# EAGLE design msp432mini_rev1.3 (EAGLE 9.6.1)
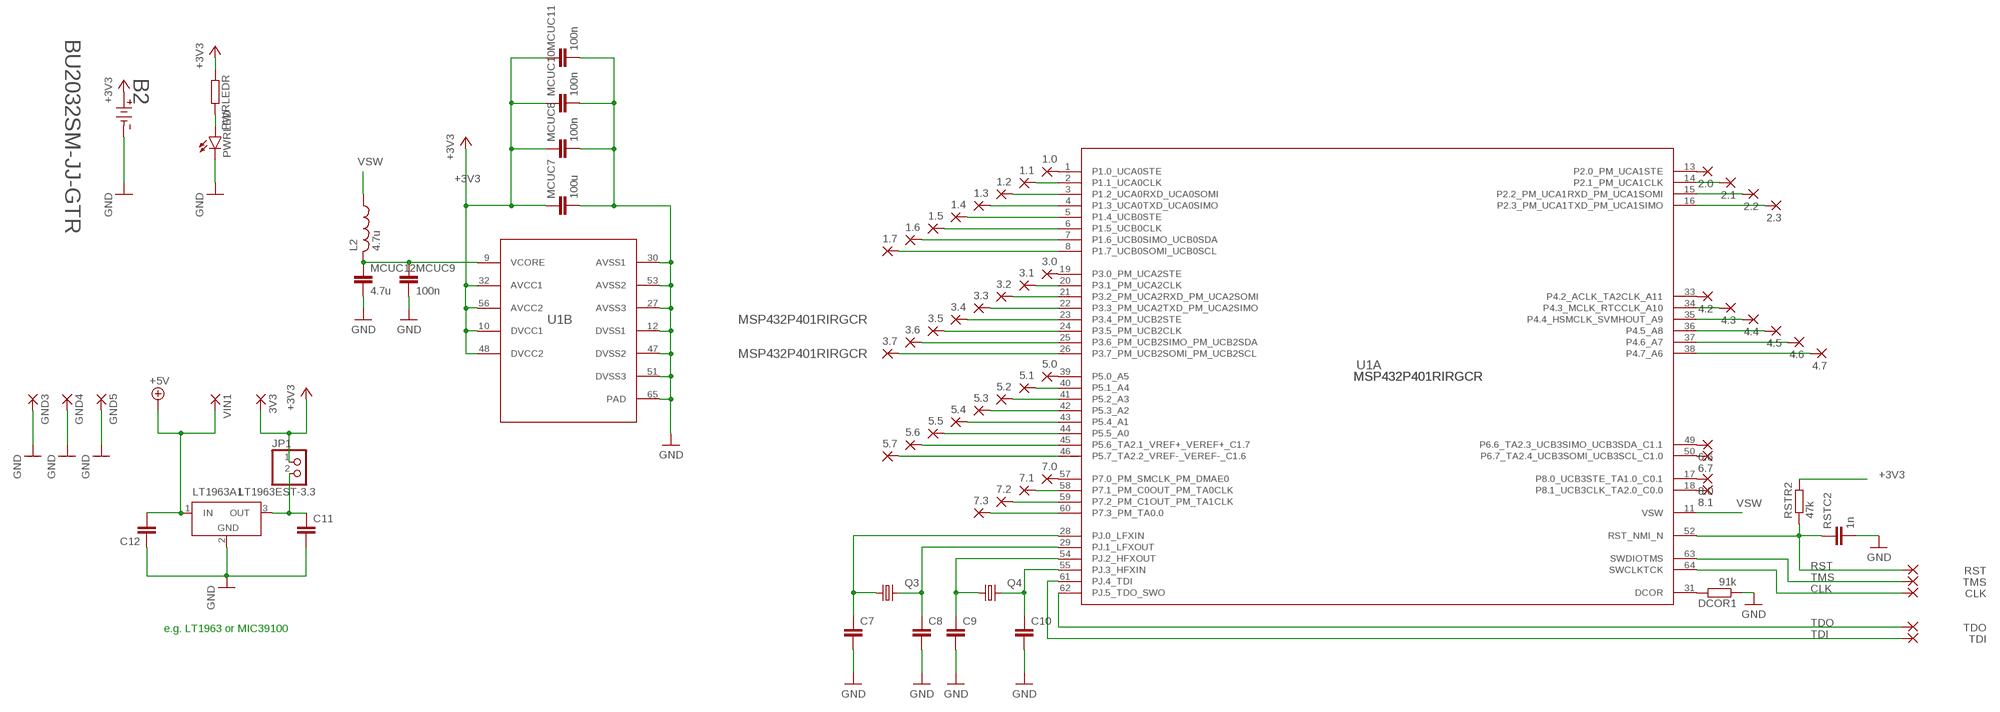
[diagram p0: schematic, sheet 1]

## Parts
1.0  1,6/0,9  [1,6/0,9]
1.1  1,6/0,9  [1,6/0,9]
1.2  1,6/0,9  [1,6/0,9]
1.3  1,6/0,9  [1,6/0,9]
1.4  1,6/0,9  [1,6/0,9]
1.5  1,6/0,9  [1,6/0,9]
1.6  1,6/0,9  [1,6/0,9]
1.7  1,6/0,9  [1,6/0,9]
2.0  1,6/0,9  [1,6/0,9]
2.1  1,6/0,9  [1,6/0,9]
2.2  1,6/0,9  [1,6/0,9]
2.3  1,6/0,9  [1,6/0,9]
3.0  1,6/0,9  [1,6/0,9]
3.1  1,6/0,9  [1,6/0,9]
3.2  1,6/0,9  [1,6/0,9]
3.3  1,6/0,9  [1,6/0,9]
3.4  1,6/0,9  [1,6/0,9]
3.5  1,6/0,9  [1,6/0,9]
3.6  1,6/0,9  [1,6/0,9]
3.7  1,6/0,9  [1,6/0,9]
3V3  1,6/0,9  [1,6/0,9]
4.2  1,6/0,9  [1,6/0,9]
4.3  1,6/0,9  [1,6/0,9]
4.4  1,6/0,9  [1,6/0,9]
4.5  1,6/0,9  [1,6/0,9]
4.6  1,6/0,9  [1,6/0,9]
4.7  1,6/0,9  [1,6/0,9]
5.0  1,6/0,9  [1,6/0,9]
5.1  1,6/0,9  [1,6/0,9]
5.2  1,6/0,9  [1,6/0,9]
5.3  1,6/0,9  [1,6/0,9]
5.4  1,6/0,9  [1,6/0,9]
5.5  1,6/0,9  [1,6/0,9]
5.6  1,6/0,9  [1,6/0,9]
5.7  1,6/0,9  [1,6/0,9]
6.6  1,6/0,9  [1,6/0,9]
6.7  1,6/0,9  [1,6/0,9]
7.0  1,6/0,9  [1,6/0,9]
7.1  1,6/0,9  [1,6/0,9]
7.2  1,6/0,9  [1,6/0,9]
7.3  1,6/0,9  [1,6/0,9]
8.0  1,6/0,9  [1,6/0,9]
8.1  1,6/0,9  [1,6/0,9]
B2  BU2032SM-JJ-GTR  [BU2032SM-JJ-GTR_MPD]
C7  C-EUC0402K  [C0402K]
C8  C-EUC0402K  [C0402K]
C9  C-EUC0402K  [C0402K]
C10  C-EUC0402K  [C0402K]
C11  C-EUC1206K  [C1206K]
C12  C-EUC1206K  [C1206K]
CLK  1,6/0,9  [1,6/0,9]
DCOR1  91k  R-EU_R0603  [R0603]
GND3  1,6/0,9  [1,6/0,9]
GND4  1,6/0,9  [1,6/0,9]
GND5  1,6/0,9  [1,6/0,9]
JP1  PINHD-1X2  [1X02]
L2  4.7u  L-USL2012C  [L2012C]
LT1963A1  LT1963EST-3.3  [SOT223]
MCUC7  100u  C-EUC1206K  [C1206K]
MCUC8  100n  C-EUC0603K  [C0603K]
MCUC9  100n  C-EUC0603K  [C0603K]
MCUC10  100n  C-EUC0603K  [C0603K]
MCUC11  100n  C-EUC0603K  [C0603K]
MCUC12  4.7u  C-EUC0603K  [C0603K]
PWRLED  LEDCHIP-LED0805  [CHIP-LED0805]
PWRLEDR  R-EU_R0603  [R0603]
Q3  KX-327-NHF  [3.2X1.5]
Q4  KX-7  [3.2X2.5_KX-7]
RST  1,6/0,9  [1,6/0,9]
RSTC2  1n  C-EUC0603K  [C0603K]
RSTR2  47k  R-EU_R0603  [R0603]
TDI  1,6/0,9  [1,6/0,9]
TDO  1,6/0,9  [1,6/0,9]
TMS  1,6/0,9  [1,6/0,9]
U1  MSP432P401RIRGCR  [RGC0064B]
VIN1  1,6/0,9  [1,6/0,9]

## Nets
+3V3: 3V3.1(P) B2.2 JP1.1 MCUC7.1 MCUC8.1 MCUC10.1 MCUC11.1 PWRLEDR.1 RSTR2.2 U1.10(B:DVCC1) U1.32(B:AVCC1) U1.48(B:DVCC2) U1.56(B:AVCC2)
+5V: C12.2 LT1963A1.1(IN) VIN1.1(P)
CLK: CLK.1(P) U1.64(A:SWCLKTCK)
GND: B2.1 C7.2 C8.2 C9.2 C10.2 C11.2 C12.1 DCOR1.1 GND3.1(P) GND4.1(P) GND5.1(P) LT1963A1.2(GND) MCUC7.2 MCUC8.2 MCUC9.2 MCUC10.2 MCUC11.2 MCUC12.2 PWRLED.C RSTC2.2 U1.12(B:DVSS1) U1.27(B:AVSS3) U1.30(B:AVSS1) U1.47(B:DVSS2) U1.51(B:DVSS3) U1.53(B:AVSS2) U1.65(B:PAD)
N$1: C11.1 JP1.2 LT1963A1.3(OUT)
N$48: L2.2 MCUC9.1 MCUC12.1 U1.9(B:VCORE)
N$51: C7.1 Q3.1 U1.28(A:PJ.0_LFXIN)
N$53: C8.1 Q3.2 U1.29(A:PJ.1_LFXOUT)
N$54: 5.0.1(P) U1.39(A:P5.0_A5)
N$55: 4.2.1(P) U1.33(A:P4.2_ACLK_TA2CLK_A11)
N$56: PWRLED.A PWRLEDR.2
N$57: C10.1 Q4.3 U1.55(A:PJ.3_HFXIN)
N$58: C9.1 Q4.1 U1.54(A:PJ.2_HFXOUT)
N$59: 3.0.1(P) U1.19(A:P3.0_PM_UCA2STE)
N$60: 3.1.1(P) U1.20(A:P3.1_PM_UCA2CLK)
N$61: 3.2.1(P) U1.21(A:P3.2_PM_UCA2RXD_PM_UCA2SOMI)
N$62: 3.3.1(P) U1.22(A:P3.3_PM_UCA2TXD_PM_UCA2SIMO)
N$63: 3.4.1(P) U1.23(A:P3.4_PM_UCB2STE)
N$64: 3.5.1(P) U1.24(A:P3.5_PM_UCB2CLK)
N$65: 3.6.1(P) U1.25(A:P3.6_PM_UCB2SIMO_PM_UCB2SDA)
N$66: 3.7.1(P) U1.26(A:P3.7_PM_UCB2SOMI_PM_UCB2SCL)
N$67: 5.1.1(P) U1.40(A:P5.1_A4)
N$68: 5.2.1(P) U1.41(A:P5.2_A3)
N$69: 5.3.1(P) U1.42(A:P5.3_A2)
N$70: 5.4.1(P) U1.43(A:P5.4_A1)
N$71: 5.5.1(P) U1.44(A:P5.5_A0)
N$72: 5.6.1(P) U1.45(A:P5.6_TA2.1_VREF+_VEREF+_C1.7)
N$73: 5.7.1(P) U1.46(A:P5.7_TA2.2_VREF-_VEREF-_C1.6)
N$74: 4.3.1(P) U1.34(A:P4.3_MCLK_RTCCLK_A10)
N$75: 4.4.1(P) U1.35(A:P4.4_HSMCLK_SVMHOUT_A9)
N$76: 4.5.1(P) U1.36(A:P4.5_A8)
N$77: 4.6.1(P) U1.37(A:P4.6_A7)
N$78: 4.7.1(P) U1.38(A:P4.7_A6)
N$79: 2.0.1(P) U1.13(A:P2.0_PM_UCA1STE)
N$80: 2.1.1(P) U1.14(A:P2.1_PM_UCA1CLK)
N$81: 2.2.1(P) U1.15(A:P2.2_PM_UCA1RXD_PM_UCA1SOMI)
N$82: 2.3.1(P) U1.16(A:P2.3_PM_UCA1TXD_PM_UCA1SIMO)
N$83: 1.0.1(P) U1.1(A:P1.0_UCA0STE)
N$84: 1.1.1(P) U1.2(A:P1.1_UCA0CLK)
N$85: 1.2.1(P) U1.3(A:P1.2_UCA0RXD_UCA0SOMI)
N$86: 1.3.1(P) U1.4(A:P1.3_UCA0TXD_UCA0SIMO)
N$87: 1.4.1(P) U1.5(A:P1.4_UCB0STE)
N$88: 1.5.1(P) U1.6(A:P1.5_UCB0CLK)
N$89: 1.6.1(P) U1.7(A:P1.6_UCB0SIMO_UCB0SDA)
N$90: 1.7.1(P) U1.8(A:P1.7_UCB0SOMI_UCB0SCL)
N$91: 6.6.1(P) U1.49(A:P6.6_TA2.3_UCB3SIMO_UCB3SDA_C1.1)
N$92: 6.7.1(P) U1.50(A:P6.7_TA2.4_UCB3SOMI_UCB3SCL_C1.0)
N$93: 8.0.1(P) U1.17(A:P8.0_UCB3STE_TA1.0_C0.1)
N$94: 8.1.1(P) U1.18(A:P8.1_UCB3CLK_TA2.0_C0.0)
N$95: 7.0.1(P) U1.57(A:P7.0_PM_SMCLK_PM_DMAE0)
N$96: 7.1.1(P) U1.58(A:P7.1_PM_C0OUT_PM_TA0CLK)
N$97: 7.2.1(P) U1.59(A:P7.2_PM_C1OUT_PM_TA1CLK)
N$98: 7.3.1(P) U1.60(A:P7.3_PM_TA0.0)
N$99: DCOR1.2 U1.31(A:DCOR)
RST: RST.1(P) RSTC2.1 RSTR2.1 U1.52(A:RST_NMI_N)
TDI: TDI.1(P) U1.61(A:PJ.4_TDI)
TDO: TDO.1(P) U1.62(A:PJ.5_TDO_SWO)
TMS: TMS.1(P) U1.63(A:SWDIOTMS)
VSW: L2.1 U1.11(A:VSW)

## Notes on the sheet
- e.g. LT1963 or MIC39100

## Power pins joined to a net without a drawn wire
GND: LT1963A1.4(GND)

## Library data of the parts
1.0 1.1-1.7 2.0 2.1-2.3 3.0 3.1-3.7 3V3 4.2-4.7 5.0 5.1-5.7 6.6 6.7 7.0 7.1-7.3 8.0 8.1 CLK GND3-GND5 RST TDI TDO TMS VIN1 = wirepad:1,6/0,9: THROUGH-HOLE PAD
B2 = BU2032SM-FH-GTR:BU2032SM-JJ-GTR; BUILT_BY: EMA_Cory; COPYRIGHT: Copyright (C) 2018 Accelerated Designs. All rights reserved; DATASHEET: https://www.memoryprotectiondevices.com/datasheets/BU2032SM-JJ-GTR-datasheet.pdf; MANUFACTURER_PART_NUMBER: BU2032SM-JJ-GTR; SOURCELIBRARY: Memory_Protection_Devices_2020-07-31; VENDOR: Memory Protection Devices, Inc
C7-C12 RSTC2 = rcl:C-EU: CAPACITOR, European symbol; SPICEPREFIX: C
DCOR1 PWRLEDR RSTR2 = rcl:R-EU_: RESISTOR, European symbol; SPICEPREFIX: R
JP1 = pinhead:PINHD-1X2: PIN HEADER
L2 = rcl:L-US: INDUCTOR, American symbol; SPICEPREFIX: L
LT1963A1 = linear-technology:LT1963EST: 1.5A, Low Noise, Fast Transient Response LDO Regulator Source: http://www.linear.com/pc/downloadDocument.do?navId=H0,C3,P2222,D3148; MPN: LT1963EST-3.3; OC_FARNELL: 1501032; OC_NEWARK: 57M7546
MCUC7-MCUC12 = resistor:C-EU: CAPACITOR, European symbol
PWRLED = led:LED: LED OSRAM: - CHIPLED LG R971, LG N971, LY N971, LG Q971, LY Q971, LO R971, LY R971 LH N974, LH R974 LS Q976, LO Q976, LY Q976 LO Q996 - Hyper CHIPLED LW Q18S LB Q993, LB Q99A, LB R99A - SideLED LS A670, LO A670, LY A670, LG A670, LP A670 LB A673, LV A673, LT A673, LW A673 LH A674 LY A675 LS A676, LA A676, LO A676, LY A676, LW A676 LS A679, LY A679, LG A679 - Hyper Micro SIDELED® LS Y876, LA Y876, LO Y876, LY Y876 LT Y87S - SmartLED LW L88C, LW L88S LB L89C, LB L89S, LG L890 LS L89K, LO L89K, LY L89K LS L896, LA L896, LO L896, LY L896 - TOPLED LS T670, LO T670, LY T670, LG T670, LP T670 LSG T670, LSP T670, LSY T670, LOP T670, LYG T670 LG T671, LOG T671, LSG T671 LB T673, LV T673, LT T673, LW T673 LH T674 LS T676, LA T676, LO T676, LY T676, LB T676, LH T676, LSB T676, LW T676 LB T67C, LV T67C, LT T67C, LS T67K, LO T67K, LY T67K, LW E67C LS E67B, LA E67B, LO E67B, LY E67B, LB E67C, LV E67C, LT E67C LW T67C LS T679, LY T679, LG T679 LS T770, LO T770, LY T770, LG T770, LP T770 LB T773, LV T773, LT T773, LW T773 LH T774 LS E675, LA E675, LY E675, LS T675 LS T776, LA T776, LO T776, LY T776, LB T776 LHGB T686 LT T68C, LB T68C - Hyper Mini TOPLED® LB M676 - Mini TOPLED Santana® LG M470 LS M47K, LO M47K, LY M47K Source: http://www.osram.convergy.de LUXEON: - LUMILED® LXK2-PW12-R00, LXK2-PW12-S00, LXK2-PW14-U00, LXK2-PW14-V00 LXK2-PM12-R00, LXK2-PM12-S00, LXK2-PM14-U00 LXK2-PE12-Q00, LXK2-PE12-R00, LXK2-PE12-S00, LXK2-PE14-T00, LXK2-PE14-U00 LXK2-PB12-K00, LXK2-PB12-L00, LXK2-PB12-M00, LXK2-PB14-N00, LXK2-PB14-P00, LXK2-PB14-Q00 LXK2-PR12-L00, LXK2-PR12-M00, LXK2-PR14-Q00, LXK2-PR14-R00 LXK2-PD12-Q00, LXK2-PD12-R00, LXK2-PD12-S00 LXK2-PH12-R00, LXK2-PH12-S00 LXK2-PL12-P00, LXK2-PL12-Q00, LXK2-PL12-R00 Source: www.luxeon.com KINGBRIGHT: KA-3528ASYC Source: www.kingbright.com
Q3 = crystal-geyer_V1_0:KX-327: Tuning Fork Crystals (kHz) SMD: KX327 - Serie Model Size l/w/h [mm] Frequency Range Frequency Stability Temp. Range [°C] Load Capacitance AECQ 200 availabel Datasheet KX-327VT KX-327FT KX-327RT KX-327NHT KX-327NHF KX-327L KX-327S 1.25/1.05/0.5 1.6/1.0/0.5 2.0/1.2/0.6 3.2/1.5/0.8 3.2/1.5/0.8 7.0/1.5/1.4 8.2/3.8/2.5 32,768 kHz 32,768 kHz 32,768 kHz 32,768 kHz 32,768 kHz 32,768 kHz 32,768 kHz ±10 … ±20ppm ±10 … ±20ppm ±10 … ±20ppm ±10 … ±20ppm ±10 … ±20ppm ±10 … ±20ppm ±5 … ±20ppm (*) -40°C …+85°C (*) -40°C …+85°C (*) -40°C …+85°C (*) -40°C …+85°C (*) -40°C …+125°C (*) -40°C …+85°C (*) -40°C …+85°C 7/9/12,5 7/9/12,5 7/9/12,6 7/9/12,5 9/12,5 7/9/12,5 6/12,5 - - - - yes - - KX-327VT.pdf <http://www.geyer-electronic.de/uploads/tx_userartikelfrequenz/GEYER-KX-327VT.pdf> KX-327FT.pdf <http://www.geyer-electronic.de/uploads/tx_userartikelfrequenz/GEYER-KX-327FT.pdf> KX-327RT.pdf <http://www.geyer-electronic.de/uploads/tx_userartikelfrequenz/GEYER-KX-327RT.pdf> KX-327NHT.pdf <http://www.geyer-electronic.de/uploads/tx_userartikelfrequenz/GEYER-KX-327NHT.pdf> KX-327NHF.pdf <http://www.geyer-electronic.de/uploads/tx_userartikelfrequenz/GEYER-KX-327NHF.pdf> KX-327L.pdf <http://www.geyer-electronic.de/uploads/tx_userartikelfrequenz/GEYER-KX-327L.pdf> KX-327S.pdf <http://www.geyer-electronic.de/uploads/tx_userartikelfrequenz/GEYER-KX-327S.pdf> <http://www.geyer-electronic.de/fileadmin/template/img/logo-geyer-electronic.png> Details see: http://www.geyer-electronic.de/Frequenz-Produkte.9.0.html Created 2016-06-07, Hans Locher 2016 (C) Geyer Quartz Technology KX327VT,KX327FT,KX327RT,KX327NHT,KX327NHF,KX327S,KX327L;125105;1610;2012;3215;7015;8238;1,25x1,05,1.25x1.05;1,6x1,0,1.6x1.0;2,0x1,2,2.0x1.2;3,2x1,5,3.2x1.5;8,2x3,8,8.2x3.8,7.0x1.5,7,0x1,532.768kHz
Q4 = crystal-geyer_V1_0:KX: Quartz Crystals (MHz) SMD: KX - Serie Model Size l/w/h [mm] Frequency Range Frequency Stability Temp. Range [°C] Load Capacitance AECQ 200 availabel Datasheet KX-4 KX-5 KX-6 KX-7 KX-9A KX-9B KX-12A KX-12B KX-13 KX-20 KX-K KX-KS 1.6/1.2/0.3 2.0/1.6/0.45 2.5/2.0/0.55 3.2/2.5/0.8 5.0/3.2/1.0 5.0/3.2/1.1 6.0/3.5/1.1 6.0/3.5/1.0 7.0/5.0 /1.3 11.6/5.5/1.6 12.3/4.5/4.2 12.3/4.5/3.2 24.0 ~ 80.0 MHz 16.0 ~ 80.0 MHz 12.0 ~ 80.0 MHz 8.0 ~ 60.0 MHz 7,68 ~ 300,0 MHz 8,0 ~ 50,0 MHz 8,0 ~ 150,0 MHz 8,0 ~ 50,0 MHz 6,0 ~ 160,0 MHz 3,579 ~ 25,0 MHz 3,579 ~ 70,0 MHz 3,579 ~ 70,0 MHz ±10 … ±50ppm ±10 … ±50ppm ±10 … ±50ppm ±10 … ±50ppm ±10 … ±50ppm ±10 … ±50ppm ±10 … ±50ppm ±10 … ±50ppm ±10 … ±50ppm ±50ppm ±10 … ±50ppm ±10 … ±50ppm (*) -40°C …+85°C (*) -40°C …+125°C (*) -40°C …+125°C (*) -40°C …+125°C (*) -40°C …+105°C (*) -40°C …+105°C (*) -40°C …+125°C (*) -40°C …+105°C (*) -40°C …+105°C (*) -40°C …+105°C (*) -40°C …+85°C (*) -40°C …+85°C 8, 8…16 8, 8…16 10, 8…16 12, 7…20 16, 10…20 16, 10…20 16, 10…20 16, 12…20 16, 12…20 16, 12…20 16, 12…30 16, 12…30 - yes yes yes - - - - - - - - KX-4.pdf <http://www.geyer-electronic.de/uploads/tx_userartikelfrequenz/GEYER-KX-4.pdf> KX-5.pdf <http://www.geyer-electronic.de/uploads/tx_userartikelfrequenz/GEYER-KX-5.pdf> KX-6.pdf <http://www.geyer-electronic.de/uploads/tx_userartikelfrequenz/GEYER-KX-6.pdf> KX-7.pdf <http://www.geyer-electronic.de/uploads/tx_userartikelfrequenz/GEYER-KX-7.pdf> KX-9A.pdf <http://www.geyer-electronic.de/uploads/tx_userartikelfrequenz/GEYER-KX-9A.pdf> KX-9B.pdf <http://www.geyer-electronic.de/uploads/tx_userartikelfrequenz/GEYER-KX-9B.pdf> KX-12A.pdf <http://www.geyer-electronic.de/uploads/tx_userartikelfrequenz/GEYER-KX-12A.pdf> KX-12B.pdf <http://www.geyer-electronic.de/uploads/tx_userartikelfrequenz/GEYER-KX-12B.pdf> KX-13.pdf <http://www.geyer-electronic.de/uploads/tx_userartikelfrequenz/GEYER-KX-13.pdf> KX-20.pdf <http://www.geyer-electronic.de/uploads/tx_userartikelfrequenz/GEYER-KX-20.pdf> KX-K.pdf <http://www.geyer-electronic.de/uploads/tx_userartikelfrequenz/GEYER-KX-K.pdf> KX-KS.pdf <http://www.geyer-electronic.de/uploads/tx_userartikelfrequenz/GEYER-KX-KS.pdf> <http://www.geyer-electronic.de/fileadmin/template/img/logo-geyer-electronic.png> Details see: http://www.geyer-electronic.de/Frequenz-Produkte.9.0.html Created 2016-06-07, Hans Locher 2016 (C) Geyer Quartz Technology KX4,KX5,KX6,KX7,KX9A,KX9B,KX12A,KX12B,KX13,KX20,KXK,KXKS;1612;2016;2520;3225;5032;6035;7050;11655;12345;1,6x1,2;2,0x1,6;2,5x2,0;3,2x2,5;5,0x3,2;6,0x3,5;7,0x5,0;11,6x5,5;12,3x4,5;12,3x4,5;1.6x1.2;2.0x1.6;2.5x2.0;3.2x2.5;5.0x3.2;6.0x3.5;7.0x5.0;11.6x5.5;12.3x4.5;12.3x4.5;
U1 = MSP432P401R_VQFN:MSP432P401RIRGCR

## Board
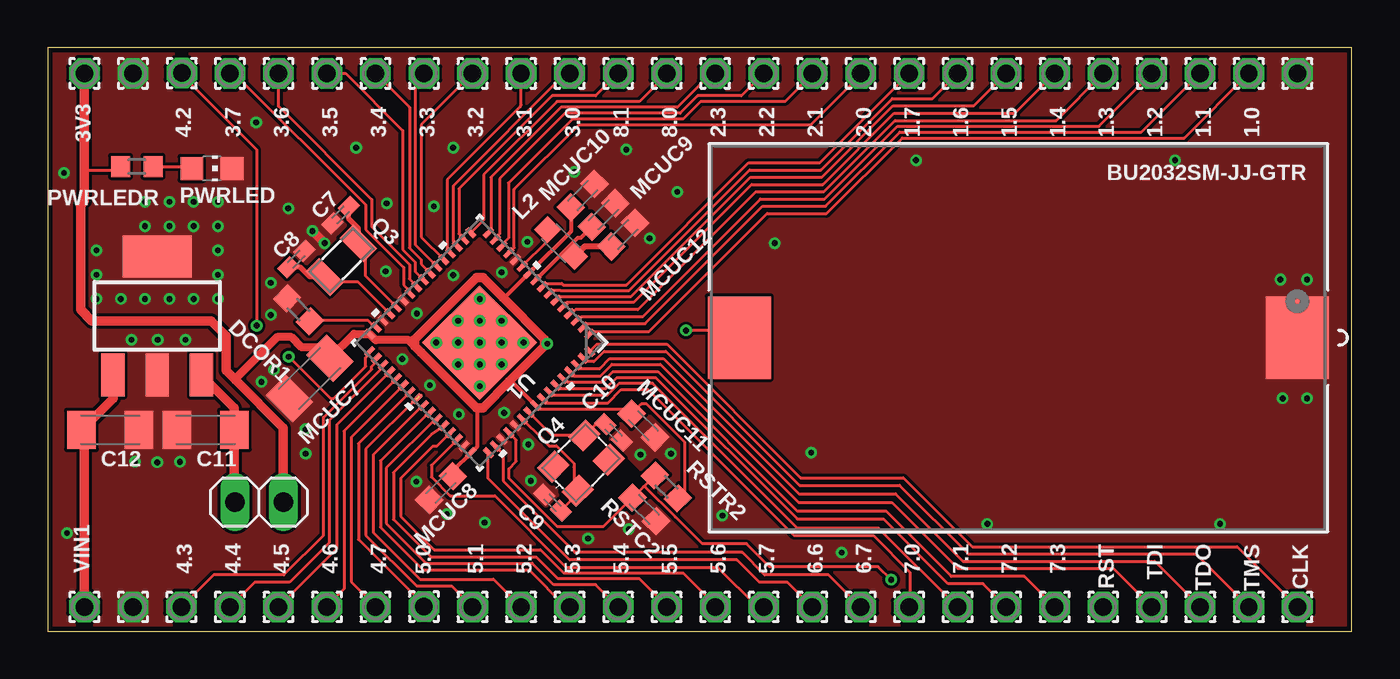
[diagram p1: board, top side]
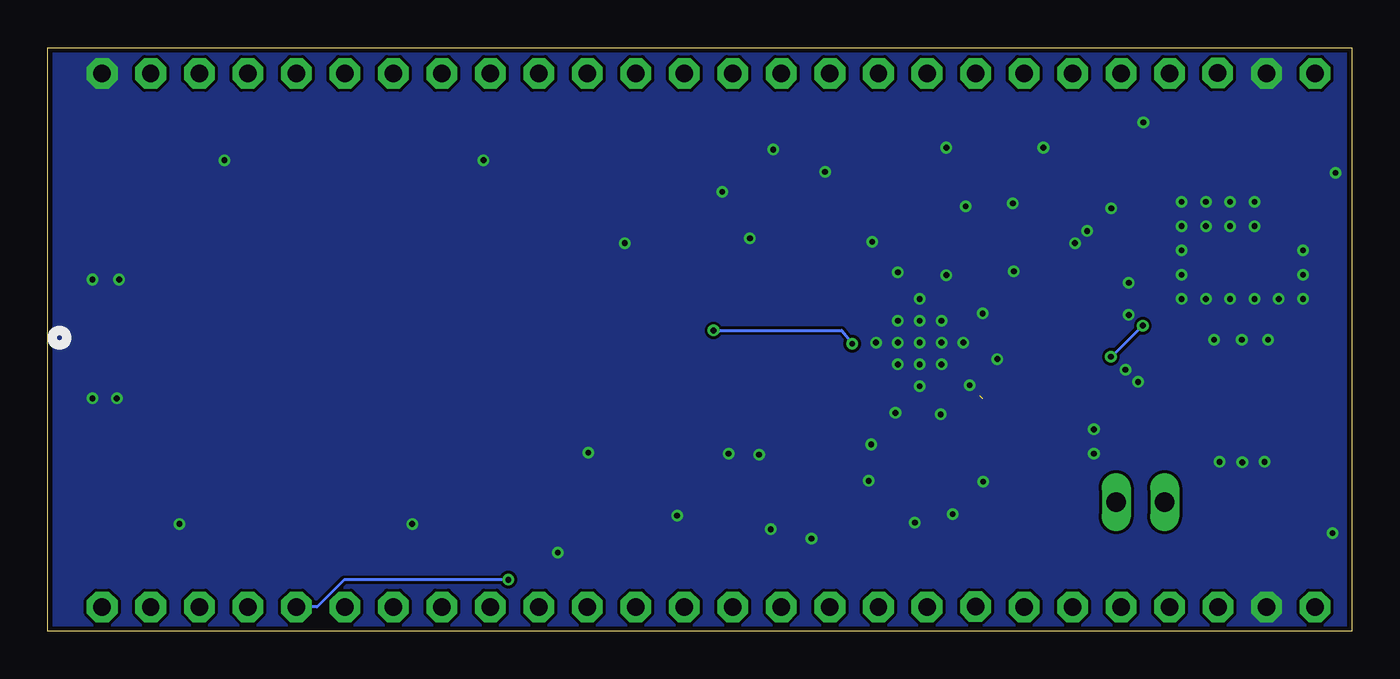
[diagram p2: board, bottom side, seen from below]

Size 68.27 x 30.55 mm. Coordinates in mm from the lower left corner, seen from the top.
Outline: 0,0 68.27,0 68.27,30.55 0,30.55 0,0
Copper layers (1*16): Top 0.035mm / dielectric 1.5mm / Bottom 0.035mm
Design rules "default *": minimum track width 6mil, minimum drill 0.35mm, track to track 6mil, track to pad 6mil, pad to pad 6mil, via to via 6mil, smd to smd 6mil, copper to edge 10mil, drill to drill 6mil, minimum pad ring 6mil, minimum via ring 6mil, stop-mask expansion 1mil, vias tented up to drill 12mil, thermal gap 10mil

### Footprints (pad centres in the part's own frame; a part is rotated, then mirrored left to right if it is on the bottom)
1,6/0,9 = drill 0.914 pad 1.6 octagon: 1 0,0
BU2032SM-JJ-GTR_MPD = smd 3.302 x 4.318: 1 14.605,0; 2 -14.605,0
C0402K = smd 0.925 x 0.74: 1 -0.6,0; 2 0.6,0
C1206K = smd 1.5 x 2: 1 -1.5,0; 2 1.5,0
R0603 = smd 1 x 1.1: 1 -0.85,0; 2 0.85,0
1X02 = drill 1.016 long: 1 -1.27,0; 2 1.27,0
L2012C = smd 1 x 1: 1 -1,0; 2 1,0
SOT223 = smd 1.219 x 2.235: 1 -2.311,-3.099; 2 0,-3.099; 3 2.311,-3.099 | smd 3.6 x 2.2: 4 0,3.099
C0603K = smd 1.05 x 1.08: 1 -0.875,0; 2 0.875,0
CHIP-LED0805 = smd 1.2 x 1.2: A 0,-1.05; C 0,1.05
3.2X1.5 = smd 1 x 1.8: 1 -1.25,0; 2 1.25,0
3.2X2.5_KX-7 = smd 1.3 x 1.1: 1 -1.15,-0.9; 2 1.15,-0.9; 3 1.15,0.9; 4 -1.15,0.9
RGC0064B = smd 0.6 x 0.24: 1 -4.4,3.75; 2 -4.4,3.25; 3 -4.4,2.75; 4 -4.4,2.25; 5 -4.4,1.75; 6 -4.4,1.25; 7 -4.4,0.75; 8 -4.4,0.25; 9 -4.4,-0.25; 10 -4.4,-0.75; 11 -4.4,-1.25; 12 -4.4,-1.75; 13 -4.4,-2.25; 14 -4.4,-2.75; 15 -4.4,-3.25; 16 -4.4,-3.75; 33 4.4,-3.75; 34 4.4,-3.25; 35 4.4,-2.75; 36 4.4,-2.25; 37 4.4,-1.75; 38 4.4,-1.25; 39 4.4,-0.75; 40 4.4,-0.25; 41 4.4,0.25; 42 4.4,0.75; 43 4.4,1.25; 44 4.4,1.75; 45 4.4,2.25; 46 4.4,2.75; 47 4.4,3.25; 48 4.4,3.75 | smd 0.24 x 0.6: 17 -3.751,-4.4; 18 -3.251,-4.4; 19 -2.751,-4.4; 20 -2.251,-4.4; 21 -1.75,-4.4; 22 -1.25,-4.4; 23 -0.75,-4.4; 24 -0.25,-4.4; 25 0.25,-4.4; 26 0.75,-4.4; 27 1.25,-4.4; 28 1.75,-4.4; 29 2.251,-4.4; 30 2.751,-4.4; 31 3.251,-4.4; 32 3.751,-4.4; 49 3.751,4.4; 50 3.251,4.4; 51 2.751,4.4; 52 2.251,4.4; 53 1.75,4.4; 54 1.25,4.4; 55 0.75,4.4; 56 0.25,4.4; 57 -0.25,4.4; 58 -0.75,4.4; 59 -1.25,4.4; 60 -1.75,4.4; 61 -2.251,4.4; 62 -2.751,4.4; 63 -3.251,4.4; 64 -3.751,4.4 | smd 4.25 x 4.25: 65 0,0

### Placement (x,y rotation side)
1.0  62.88,29.21 270 top
1.1  60.34,29.21 270 top
1.2  57.8,29.21 270 top
1.3  55.26,29.21 270 top
1.4  52.72,29.21 270 top
1.5  50.18,29.21 270 top
1.6  47.64,29.21 270 top
1.7  45.1,29.21 270 top
2.0  42.56,29.21 270 top
2.1  40.02,29.21 270 top
2.2  37.48,29.21 270 top
2.3  34.94,29.21 270 top
3.0  27.32,29.21 270 top
3.1  24.78,29.21 270 top
3.2  22.24,29.21 270 top
3.3  19.7,29.21 270 top
3.4  17.16,29.21 270 top
3.5  14.62,29.21 270 top
3.6  12.08,29.21 270 top
3.7  9.54,29.21 270 top
3V3  1.92,29.21 0 top
4.2  7.02,29.22 0 top
4.3  7,1.27 90 top
4.4  9.54,1.27 90 top
4.5  12.08,1.27 90 top
4.6  14.62,1.27 90 top
4.7  17.16,1.27 90 top
5.0  19.7,1.29 180 top
5.1  22.24,1.27 90 top
5.2  24.78,1.27 90 top
5.3  27.32,1.27 90 top
5.4  29.86,1.27 90 top
5.5  32.4,1.27 90 top
5.6  34.94,1.27 90 top
5.7  37.48,1.27 90 top
6.6  40.02,1.27 180 top
6.7  42.56,1.27 180 top
7.0  45.1,1.27 180 top
7.1  47.64,1.27 180 top
7.2  50.18,1.27 180 top
7.3  52.72,1.27 180 top
8.0  32.4,29.21 180 top
8.1  29.86,29.21 180 top
B2  50.82,15.37 0 top
C7  15.33,21.79 225 top
C8  13.02,19.48 45 top
C9  26.43,6.73 135 top
C10  29.62,10.4 315 top
C11  8.27,10.54 180 top
C12  3.27,10.54 180 top
CLK  65.42,1.27 180 top
DCOR1  13.13,16.83 315 top
GND3  4.46,29.21 0 top
GND4  4.46,1.27 0 top
GND5  65.42,29.21 0 top
JP1  11.06,6.76 180 top
L2  26.86,20.32 315 top
LT1963A1  5.73,16.51 0 top
MCUC7  13.71,13.23 225 top
MCUC8  20.59,7.49 225 top
MCUC9  29.1,21.79 45 top
MCUC10  28,22.81 45 top
MCUC11  31.18,10.77 315 top
MCUC12  30.13,20.77 45 top
PWRLED  8.6,24.23 270 top
PWRLEDR  4.66,24.33 0 top
Q3  15.38,19.43 225 top
Q4  27.92,8.8 45 top
RST  55.26,1.27 180 top
RSTC2  31.23,6.38 315 top
RSTR2  32.39,7.56 315 top
TDI  57.8,1.27 180 top
TDO  60.34,1.27 180 top
TMS  62.88,1.27 180 top
U1  22.61,15.1 225 top
VIN1  1.92,1.27 0 top

### Tracks (layer width: path | path; a pad name or v marks a point on that pad's centre or on a via)
+3V3  (via drill 0.3)
  Top 0.152: 24.79,12.57 24.78,12.57 | 24.29,13.07 24.15,13.07 | 22.49,11.64 22.45,11.7 | 23.91,17.46 23.83,17.46 | U1.56 25.72,11.64 30.31,11.64 MCUC11.1 31.06,11.89 31.36,11.89 33.34,9.91 33.34,7.33 RSTR2.2 | B2.2 35.83,15.75 v33.42,15.75 | v26.15,15.05 26.1,15.24 26.02,15.24 | PWRLEDR.1 3.61,24.13 1.92,24.13
  Top 0.2: MCUC10.1 27.38,20.94 U1.10
  Top 0.203: U1.56 24.79,12.57 24.29,13.07 | 22.49,11.64 22.49,9.68 U1.48 21.21,8.4 MCUC8.1 | U1.10 23.91,17.46
  Top 0.406: 19.55,14.59 18.9,15.24 17.17,15.24 U1.32 16.03,15.56 MCUC7.1 14.2,14.86 13.3,14.86 12.77,15.39 12,15.39 9.83,13.22 9.83,13.14
  Top 0.508: 3V3.1 1.92,24.13 1.92,22.52 1.72,22.31 1.72,16.84 2.31,16.24 8.56,16.24 9.34,15.47 9.34,13.64 9.83,13.14 12.33,10.64 JP1.1 | 22.45,11.7 22.78,11.7 24.15,13.07 26.02,14.94 26.02,15.24 26.02,15.27 23.83,17.46 22.78,18.51 22.45,18.51 19.2,15.27 19.2,14.94 19.55,14.59 22.45,11.7
  Bottom 0.152: v33.42,15.75 26.7,15.75 v26.15,15.05
+5V
  Top 0.508: VIN1.1 1.92,10.39 C12.2 3.42,12.19 LT1963A1.1
CLK
  Top 0.152: 28.39,14.63 U1.64 28.76,15.03 32.42,15.03 39.42,8.03 44.79,8.03 48.4,4.42 62.27,4.42 CLK.1 65.42,1.37
GND  (via drill 0.3)
  Top 0.152: v31.03,9.25 30.9,9.37
  Top 0.508: v14.49,20.32 v13.86,20.95
  other vias: 22.62,17.4 22.62,12.83 24.91,15.11 20.34,15.11 22.62,15.11 22.62,16.26 23.76,15.11 22.62,13.97 21.48,15.11 21.48,13.97 23.76,13.97 23.76,16.26 21.48,16.26 25.29,7.87 25.16,9.78 27.57,24.05 31.51,20.57 20.89,6.12 19.29,7.82 13.5,10.57 11.19,13.06 2.55,18.67 2.55,19.94 8.91,18.67 8.91,17.4 8.91,19.94 7.63,17.4 6.37,17.4 5.09,17.4 3.83,17.4 2.55,17.4 5.09,21.21 5.09,22.48 6.37,21.21 6.37,22.48 7.63,21.21 7.63,22.48 8.91,22.48 8.91,21.21 65.93,12.19 64.66,12.19 64.53,18.41 65.93,18.41 11.67,16.56 23.89,11.43 19.32,16.64 23.76,18.8 25.11,20.4 17.69,18.85 5.73,8.84 32.63,9.3 30.42,5.33 21.53,11.35 18.56,14.25 20,12.88 21.22,18.64 38.06,20.32 39.97,9.35 45.46,24.66 49.19,5.61 59.02,24.66 61.38,5.61 32.96,23.01 30.29,25.22 22.87,5.69 28.29,4.85 0.85,24 10.91,26.64 12.59,22.15 21.22,25.32 16.14,25.32 17.74,22.4 20.21,22.25 35.32,6.05 41.57,4.11 11.67,18.24 4.38,15.27 5.76,15.27 7.2,15.27 4.56,8.86 6.92,8.86 11.85,13.69 13.5,9.3 1.01,5.13
  pour Top (no thermals): -0.62,30.48 69.23,30.48 69.23,-1.27 -0.62,-1.27
  pour Bottom (no thermals): -0.62,30.48 69.23,30.48 69.23,-1.27 -0.62,-1.27
  cutout Top: 28.16,11.13 30.9,8.38 28.39,5.87 25.64,8.61
  cutout Top: 18.02,17.37 16.8,18.59 16.8,19.28 16.8,19.51 17.34,20.04 16.04,21.34 13.45,18.75 14.75,17.45 15.28,17.98 16.35,17.98 16.42,17.98 17.64,16.76 18.1,17.22 18.1,17.3
N$1
  Top 0.508: LT1963A1.3 9.77,11.68 C11.1 9.77,6.78 JP1.2
N$48
  Top 0.152: 27.14,19.99 27.47,19.66 L2.2
  Top 0.2: U1.9 27.14,19.99 27.74,20.59 27.9,20.59 MCUC9.1
  Top 0.305: MCUC12.1 28.1,20.15 L2.2
N$51
  Top 0.152: U1.28 16.65,18.59 16.65,19.94 Q3.1
  Top 0.254: Q3.1 16.27,21.09 15.76,21.6 C7.1
N$53
  Top 0.152: U1.29 16.24,18.29 14.76,18.29 Q3.2
  Top 0.254: Q3.2 13.73,18.55 13.21,19.06 C8.1
N$54
  Top 0.152: U1.39 18.94,12.5 16.27,9.83 16.27,4.8 19.7,1.37 5.0.1
N$55  (via drill 0.3)
  Top 0.152: v12.61,14.38 14.82,12.17 14.95,12.17 16.65,13.87 16.65,14.33 16.8,14.48 16.8,14.63 U1.33 | v10.94,16 10.94,25.22 7.05,29.11 4.2.1
  Bottom 0.152: v10.94,16 12.56,14.38 v12.61,14.38
N$56
  Top 0.152: PWRLEDR.2 7.45,24.33 PWRLED.A
N$57
  Top 0.152: C10.1 28.67,10.83 Q4.3 26.4,10.25 U1.55
N$58
  Top 0.152: C9.1 27.74,7.19 Q4.1 27.54,7.55 27.54,8.6 27.54,8.79 26.63,9.7 26.25,9.7 | 26.25,9.7 | U1.54 25.92,10.03 26.25,9.7
N$59
  Top 0.152: U1.19 21.38,20.27 21.22,20.42 21.22,23.32 27.01,29.11 27.32,29.11 3.0.1
N$60
  Top 0.152: U1.20 21.07,19.81 20.92,19.96 20.92,23.65 24.73,27.46 24.78,27.56 3.1.1
N$61
  Top 0.152: 3.2.1 19.55,26.52 19.55,21.59 19.55,20.95 19.55,20.64 U1.21 20.61,19.51
N$62
  Top 0.152: 20.31,19.2 U1.22 19.24,20.24 19.24,28.65 19.7,29.11 3.3.1
N$63
  Top 0.152: 3.4.1 18.94,27.43 18.94,20.06 19.55,19.45 19.55,19.23 U1.23 19.94,18.84 19.93,18.9
N$64
  Top 0.152: 3.5.1 15.59,29.21 18.58,26.21 18.58,19.99 19.24,19.33 19.24,18.83 U1.24
N$65
  Top 0.152: U1.25 19.24,18.14 18.94,18.44 18.94,19.2 16.96,21.18 16.96,22.61 12.08,27.48 3.6.1
N$66
  Top 0.152: U1.26 18.94,17.83 18.63,18.14 18.63,19.05 16.65,21.03 16.65,22.33 9.69,29.29 3.7.1
N$67  (1 unrouted)
  Top 0.152: 19.55,12.34 19.54,12.34 19.47,12.32 | U1.40 19.29,12.17 16.65,9.53 16.65,5.03 19.32,2.36 21.15,2.36 5.1.1
N$68
  Top 0.152: U1.41 19.55,11.73 17.03,9.22 17.03,5.16 19.48,2.72 23.33,2.72 5.2.1
N$69
  Top 0.152: U1.42 19.96,11.46 17.42,8.92 17.42,5.44 19.68,3.17 25.21,3.17 27.12,1.27 5.3.1
N$70
  Top 0.152: U1.43 20.29,11.11 17.72,8.54 17.72,5.64 19.81,3.56 25.36,3.56 26.48,2.44 28.69,2.44 5.4.1
N$71
  Top 0.152: U1.44 20.1,10.3 18.1,8.31 18.1,5.85 20.06,3.89 25.57,3.89 26.71,2.74 30.98,2.74 32.35,1.37 5.5.1
N$72
  Top 0.152: 21.07,10.36 U1.45 20.37,9.68 20.16,9.68 18.48,8 18.48,6.02 20.23,4.27 25.8,4.27 27.01,3.05 33.26,3.05 34.94,1.37 5.6.1
N$73
  Top 0.152: 21.53,10.06 U1.46 20.08,8.69 | 20.08,8.69 | 20.08,8.69 20.08,8.07 21.07,7.09 23.41,7.09 27.14,3.35 35.07,3.35 37.16,1.27 5.7.1
  Bottom 0.152: 37.02,1.27 5.7.1
N$74
  Top 0.152: 4.3.1 8.68,2.95 12.36,2.95 14.44,5.03 14.44,11.2 16.96,13.72 16.96,13.87 17.11,14.02 17.11,14.17 U1.34
N$75
  Top 0.152: 4.4.1 10.84,2.56 12.66,2.56 14.75,4.65 14.75,11.05 17.41,13.72 17.41,13.87 U1.35
N$76
  Top 0.152: U1.36 15.13,10.8 15.13,4.32 4.5.1
N$77
  Top 0.152: 18.18,13.11 U1.37 15.51,10.48 15.51,2.21 14.67,1.37 4.6.1
N$78
  Top 0.152: 18.63,12.95 U1.38 15.89,10.15 15.89,2.59 17.11,1.37 4.7.1
N$79
  Top 0.152: 24.12,19.74 U1.13 24.15,19.81 24.42,20.08 24.42,23.14 27.8,26.52 39.97,26.52 42.56,29.11 2.0.1
N$80
  Top 0.152: U1.14 23.82,20.27 24.12,20.57 24.12,23.47 27.47,26.82 33.26,26.82 34.18,27.74 38.6,27.74 39.97,29.11 2.1.1
N$81
  Top 0.152: U1.15 23.43,20.56 23.66,20.8 23.66,23.7 27.09,27.13 33.11,27.13 34.03,28.04 36.31,28.04 2.2.1
N$82
  Top 0.152: U1.16 23.15,20.95 23.21,20.95 23.21,23.77 26.86,27.43 32.96,27.43 34.63,29.11 34.94,29.11 2.3.1
N$83
  Top 0.152: U1.1 28.39,15.7 31.49,15.7 37.66,21.87 40.78,21.87 44.74,25.83 59.5,25.83 1.0.1 62.83,29.11
N$84
  Top 0.152: 60.24,29.03 60.24,29.11 1.1.1 57.27,26.14 44.61,26.14 40.73,22.25 37.43,22.25 31.28,16.1 28.18,16.1 28.08,16 U1.2
N$85
  Top 0.152: U1.3 27.78,16.31 27.93,16.46 31.13,16.46 37.3,22.63 40.68,22.63 44.49,26.44 55.03,26.44 1.2.1 57.8,29.11
N$86
  Top 0.152: U1.4 27.33,16.61 27.4,16.61 27.62,16.84 30.9,16.84 37.07,23.01 40.63,23.01 44.36,26.75 52.8,26.75 1.3.1 55.21,29.11
N$87
  Top 0.152: U1.5 27.01,17.07 27.17,17.22 30.67,17.22 36.85,23.39 40.58,23.39 44.31,27.13 50.64,27.13 1.4.1
N$88
  Top 0.152: 26.56,17.22 U1.6 26.8,17.53 30.55,17.53 36.79,23.77 40.53,23.77 44.26,27.51 48.48,27.51 1.5.1 50.18,29.11
N$89
  Top 0.152: 26.41,17.83 U1.7 26.43,17.86 26.83,17.86 26.85,17.83 30.42,17.83 36.74,24.16 40.48,24.16 44.21,27.89 46.32,27.89 1.6.1 47.59,29.11
N$90
  Top 0.152: 25.95,18.14 U1.8 25.9,18.05 26.06,18.21 26.91,18.21 26.98,18.14 30.29,18.14 36.7,24.54 40.43,24.54 1.7.1
N$91
  Top 0.152: 6.6.1 38.73,2.56 37.25,2.56 36.08,3.73 27.32,3.73 23.05,8 23.05,9.32 U1.49 23.21,9.3
N$92
  Top 0.152: 6.7.1 40.88,2.95 37.53,2.95 36.36,4.12 27.6,4.12 23.84,7.88 23.84,9.28 U1.50
N$93
  Top 0.152: U1.17 22.82,21.54 22.82,23.9 26.66,27.74 30.98,27.74 32.35,29.11 8.0.1
N$94
  Top 0.152: 8.1.1 28.69,28.04 26.41,28.04 21.53,23.16 21.53,20.8 21.68,20.65 21.68,20.57 U1.18
N$95
  Top 0.152: U1.57 25.95,12.04 26.02,11.96 29.33,11.96 30.02,12.65 31.43,12.65 39.08,5 43.22,5 45.15,3.07 45.15,1.27 7.0.1
N$96
  Top 0.152: 7.1.1 47.62,1.27 43.5,5.38 39.26,5.38 31.66,12.98 29.92,12.98 29.29,12.35 26.43,12.35 U1.58
N$97
  Top 0.152: 26.56,12.95 U1.59 26.63,12.88 26.8,12.7 29.21,12.7 29.79,13.28 31.82,13.28 39.24,5.87 43.75,5.87 47.13,2.49 48.96,2.49 7.2.1
N$98
  Top 0.152: 27.01,13.11 U1.60 27.02,13.23 27.2,13.06 29.06,13.06 29.59,13.59 31.95,13.59 39.26,6.27 43.91,6.27 47.31,2.87 51.12,2.87 7.3.1
N$99
  Top 0.152: U1.31 17.12,15.92 16.78,16.26 13.76,16.26 DCOR1.2
RST  (via drill 0.3)
  Top 0.152: 31.19,7.56 30.8,7.18 RSTC2.1 29.11,5.49 26.66,5.49 24.15,8 24.15,8.51 24.53,8.89 24.53,10.01 U1.52 | 31.19,7.56 RSTR2.1 | v44.16,2.69 43.47,3.38 37.78,3.38 36.59,4.57 34.27,4.57 32.86,5.98 31.28,7.56 31.19,7.56
  Bottom 0.152: v44.16,2.69 44.17,2.68 52.76,2.68 54.18,1.27 RST.1
TDI
  Top 0.152: 27.32,13.56 U1.61 27.54,13.36 28.93,13.36 29.54,13.97 32.07,13.97 39.31,6.73 44.18,6.73 47.64,3.28 55.79,3.28 TDI.1 57.57,1.27
TDO
  Top 0.152: 27.78,13.87 27.73,13.9 U1.62 27.67,13.92 27.83,13.77 28.9,13.77 29.41,14.27 32.23,14.27 39.32,7.19 44.39,7.19 47.92,3.66 57.95,3.66 TDO.1 60.34,1.35
TMS
  Top 0.152: 27.93,14.33 U1.63 28.19,14.12 28.6,14.12 29.13,14.66 32.36,14.66 39.37,7.64 44.59,7.64 48.2,4.04 60.11,4.04 TMS.1
  Bottom 0.152: 62.83,1.37 TMS.1
VSW
  Top 0.152: U1.11 26.16,20.43 L2.1

### Text on the board
tDocu: GND | GND | SOT-223 LDO | MSP432P401 Miniboard / Rev. 1.3 | MCUPWR | GND